# Altium schematic sheet Car2014_finalRev_sch2 (2).SchDoc
size A3
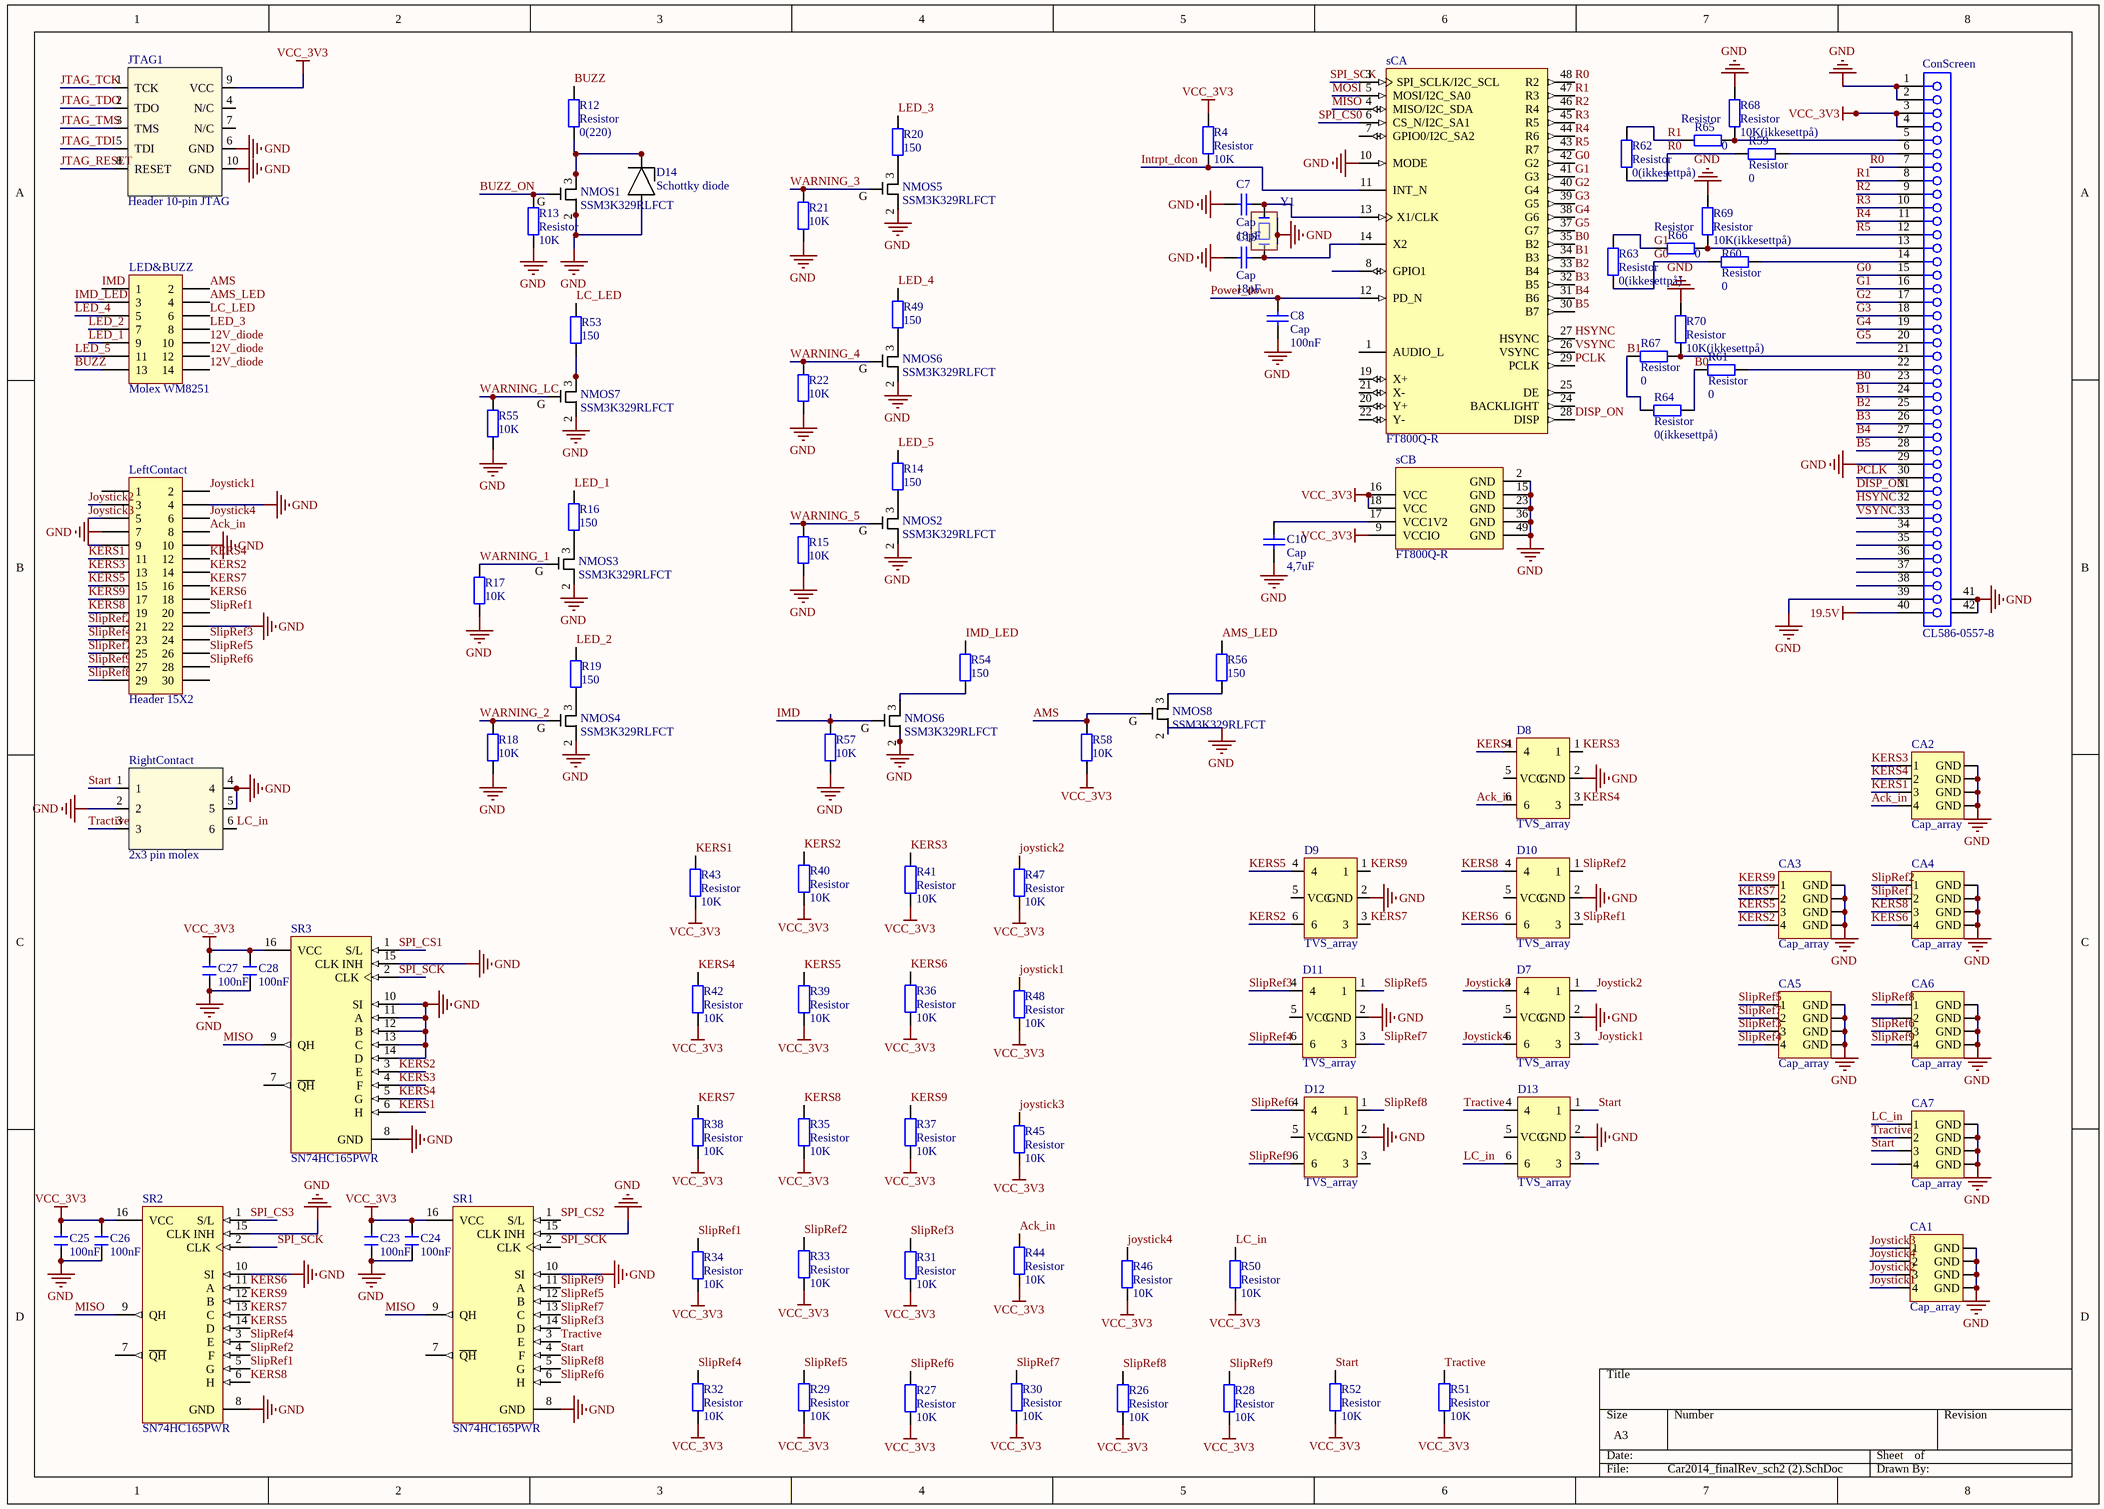
[diagram p0: Car2014_finalRev_sch2 (2).SchDoc]

## Parts
(Parts that share a designator on the sheet are numbered #1, #2 ... from top to bottom, then left to right.)
C7  Cap  value 18pF  [1608[0603]]
C8  Cap  value 100nF  [1608[0603]]
C10  Cap  value 4,7uF  [c0805]
C16  Cap  value 18pF  [1608[0603]]
C23  value 100nF  [CAPC1608L]  (hidden comment: Cap)
C24  value 100nF  [CAPC1608L]  (hidden comment: Cap)
C25  value 100nF  [CAPC1608L]  (hidden comment: Cap)
C26  value 100nF  [CAPC1608L]  (hidden comment: Cap)
C27  value 100nF  [CAPC1608L]  (hidden comment: Cap)
C28  value 100nF  [CAPC1608L]  (hidden comment: Cap)
CA1  Cap_array  [Cap_array_0805]
CA2  Cap_array  [Cap_array_0805]
CA3  Cap_array  [Cap_array_0805]
CA4  Cap_array  [Cap_array_0805]
CA5  Cap_array  [Cap_array_0805]
CA6  Cap_array  [Cap_array_0805]
CA7  Cap_array  [Cap_array_0805]
ConScreen  CL586-0557-8  [FH12A-40S-0.5SH]
D7  TVS_array  [TVS_array_SOT23]
D8  TVS_array  [TVS_array_SOT23]
D9  TVS_array  [TVS_array_SOT23]
D10  TVS_array  [TVS_array_SOT23]
D11  TVS_array  [TVS_array_SOT23]
D12  TVS_array  [TVS_array_SOT23]
D13  TVS_array  [TVS_array_SOT23]
D14  Schottky diode  [1608[0603]]
JTAG1  Header 10-pin JTAG  [10pin Header]
LED&BUZZ  Molex WM8251  [HDR2X7]
LeftContact  Header 15X2  [HDR2X15]
NMOS1  SSM3K329RLFCT  [SOT23]
NMOS2  SSM3K329RLFCT  [SOT23]
NMOS3  SSM3K329RLFCT  [SOT23]
NMOS4  SSM3K329RLFCT  [SOT23]
NMOS5  SSM3K329RLFCT  [SOT23]
NMOS6#1  SSM3K329RLFCT  [SOT23]
NMOS6#2  SSM3K329RLFCT  [SOT23]
NMOS7  SSM3K329RLFCT  [SOT23]
NMOS8  SSM3K329RLFCT  [SOT23]
R4  Resistor  value 10K  [1608[0603]]
R12  Resistor  value 0(220)  [1608[0603]]
R13  Resistor  value 10K  [1608[0603]]
R14  value 150  [RESC1608L]  (hidden comment: Resistor)
R15  value 10K  [RESC1608L]  (hidden comment: Resistor)
R16  value 150  [RESC1608L]  (hidden comment: Resistor)
R17  value 10K  [RESC1608L]  (hidden comment: Resistor)
R18  value 10K  [RESC1608L]  (hidden comment: Resistor)
R19  value 150  [RESC1608L]  (hidden comment: Resistor)
R20  value 150  [RESC1608L]  (hidden comment: Resistor)
R21  value 10K  [RESC1608L]  (hidden comment: Resistor)
R22  value 10K  [RESC1608L]  (hidden comment: Resistor)
R26  Resistor  value 10K  [1608[0603]]
R27  Resistor  value 10K  [1608[0603]]
R28  Resistor  value 10K  [1608[0603]]
R29  Resistor  value 10K  [1608[0603]]
R30  Resistor  value 10K  [1608[0603]]
R31  Resistor  value 10K  [1608[0603]]
R32  Resistor  value 10K  [1608[0603]]
R33  Resistor  value 10K  [1608[0603]]
R34  Resistor  value 10K  [1608[0603]]
R35  Resistor  value 10K  [1608[0603]]
R36  Resistor  value 10K  [1608[0603]]
R37  Resistor  value 10K  [1608[0603]]
R38  Resistor  value 10K  [1608[0603]]
R39  Resistor  value 10K  [1608[0603]]
R40  Resistor  value 10K  [1608[0603]]
R41  Resistor  value 10K  [1608[0603]]
R42  Resistor  value 10K  [1608[0603]]
R43  Resistor  value 10K  [1608[0603]]
R44  Resistor  value 10K  [1608[0603]]
R45  Resistor  value 10K  [1608[0603]]
R46  Resistor  value 10K  [1608[0603]]
R47  Resistor  value 10K  [1608[0603]]
R48  Resistor  value 10K  [1608[0603]]
R49  value 150  [RESC1608L]  (hidden comment: Resistor)
R50  Resistor  value 10K  [1608[0603]]
R51  Resistor  value 10K  [1608[0603]]
R52  Resistor  value 10K  [1608[0603]]
R53  value 150  [RESC1608L]  (hidden comment: Resistor)
R54  value 150  [RESC1608L]  (hidden comment: Resistor)
R55  value 10K  [RESC1608L]  (hidden comment: Resistor)
R56  value 150  [RESC1608L]  (hidden comment: Resistor)
R57  value 10K  [RESC1608L]  (hidden comment: Resistor)
R58  value 10K  [RESC1608L]  (hidden comment: Resistor)
R59  Resistor  value 0  [1608[0603]]
R60  Resistor  value 0  [1608[0603]]
R61  Resistor  value 0  [1608[0603]]
R62  Resistor  value 0(ikkesettpå)  [1608[0603]]
R63  Resistor  value 0(ikkesettpå)  [1608[0603]]
R64  Resistor  value 0(ikkesettpå)  [1608[0603]]
R65  Resistor  value 0  [1608[0603]]
R66  Resistor  value 0  [1608[0603]]
R67  Resistor  value 0  [1608[0603]]
R68  Resistor  value 10K(ikkesettpå)  [1608[0603]]
R69  Resistor  value 10K(ikkesettpå)  [1608[0603]]
R70  Resistor  value 10K(ikkesettpå)  [1608[0603]]
RightContact  2x3 pin molex  [2x3 pin molex]
sC  FT800Q-R  [VQFN-48_N]  (parts A,B of 2)
SR1  SN74HC165PWR  [TSOP65P640X120-16N]
SR2  SN74HC165PWR  [TSOP65P640X120-16N]
SR3  SN74HC165PWR  [TSOP65P640X120-16N]
Y1  Crystal  [SMD-CRYSTAL]  (value not drawn)

## Nets
19.5V: ConScreen.40
GND: C7.1 C8.1 C10.1 C16.1 C23.1 C24.1 C25.1 C26.1 C27.1 C28.1 CA1.5(GND) CA1.6(GND) CA1.7(GND) CA1.8(GND) CA2.5(GND) CA2.6(GND) CA2.7(GND) CA2.8(GND) CA3.5(GND) CA3.6(GND) CA3.7(GND) CA3.8(GND) CA4.5(GND) CA4.6(GND) CA4.7(GND) CA4.8(GND) CA5.5(GND) CA5.6(GND) CA5.7(GND) CA5.8(GND) CA6.5(GND) CA6.6(GND) CA6.7(GND) CA6.8(GND) CA7.5(GND) CA7.6(GND) CA7.7(GND) CA7.8(GND) ConScreen.1 ConScreen.2 ConScreen.29 ConScreen.39 ConScreen.41(MH1) ConScreen.42(MH2) D7.2(GND) D8.2(GND) D9.2(GND) D10.2(GND) D11.2(GND) D12.2(GND) D13.2(GND) D14.2 JTAG1.6(GND) JTAG1.10(GND) LeftContact.4 LeftContact.7 LeftContact.10 LeftContact.22 NMOS1.2(S) NMOS2.2(S) NMOS3.2(S) NMOS4.2(S) NMOS5.2(S) NMOS6#1.2(S) NMOS6#2.2(S) NMOS7.2(S) NMOS8.2(S) R13.2 R15.2 R17.2 R18.2 R21.2 R22.2 R55.1 R57.2 R68.1 R69.2 R70.2 RightContact.2 RightContact.4 RightContact.5 sC.2(GND) sC.10(MODE) sC.15(GND) sC.23(GND) sC.36(GND) sC.49(GND) SR1.8(GND) SR1.10(SI) SR1.15(CLK_INH) SR2.8(GND) SR2.10(SI) SR2.15(CLK_INH) SR3.8(GND) SR3.10(SI) SR3.11(A) SR3.12(B) SR3.13(C) SR3.14(D) SR3.15(CLK_INH) Y1.2 Y1.4
VCC_3V3: C23.2 C24.2 C25.2 C26.2 C27.2 C28.2 ConScreen.3 ConScreen.4 JTAG1.9(VCC) R4.2 R26.2 R27.2 R28.2 R29.2 R30.2 R31.2 R32.2 R33.2 R34.2 R35.2 R36.2 R37.2 R38.2 R39.2 R40.2 R41.2 R42.2 R43.2 R44.1 R45.1 R46.1 R47.1 R48.1 R50.1 R51.2 R52.2 R58.1 sC.9(VCCIO) sC.16(VCC) sC.18(VCC) SR1.16(VCC) SR2.16(VCC) SR3.16(VCC)
12V_diode: LED&BUZZ.10 LED&BUZZ.12 LED&BUZZ.14
Ack_in: CA2.4 D8.6 LeftContact.8 R44.2
AMS: LED&BUZZ.2 NMOS8.1(G) R58.2
AMS_LED: LED&BUZZ.4 R56.1
B0: ConScreen.23 R61.1 R64.2 sC.35(B2)
B1: ConScreen.24 R64.1 R67.1 sC.34(B3)
B2: ConScreen.25 sC.33(B4)
B3: ConScreen.26 sC.32(B5)
B4: ConScreen.27 sC.31(B6)
B5: ConScreen.28 sC.30(B7)
BUZZ: LED&BUZZ.13 R12.1
BUZZ_ON: NMOS1.1(G) R13.1
DISP_ON: ConScreen.31 sC.28(DISP)
G0: ConScreen.15 R60.2 R63.2 sC.42(G2)
G1: ConScreen.16 R63.1 R66.2 sC.41(G3)
G2: ConScreen.17 sC.40(G4)
G3: ConScreen.18 sC.39(G5)
G4: ConScreen.19 sC.38(G6)
G5: ConScreen.20 sC.37(G7)
HSYNC: ConScreen.32 sC.27(HSYNC)
IMD: LED&BUZZ.1 NMOS6#2.1(G) R57.1
IMD_LED: LED&BUZZ.3 R54.2
Intrpt_dcon: R4.1 sC.11(INT_N)
Joystick1: CA1.4 D7.3 LeftContact.2 R48.2
Joystick2: CA1.3 D7.1 LeftContact.3 R47.2
Joystick3: CA1.1 D7.4 LeftContact.5 R45.2
Joystick4: CA1.2 D7.6 LeftContact.6 R46.2
JTAG_RESET: JTAG1.8(RESET)
JTAG_TCK: JTAG1.1(TCK)
JTAG_TDI: JTAG1.5(TDI)
JTAG_TDO: JTAG1.2(TDO)
JTAG_TMS: JTAG1.3(TMS)
KERS1: CA2.3 D8.4 LeftContact.11 R43.1 SR3.6(H)
KERS2: CA3.4 D9.6 LeftContact.14 R40.1 SR3.3(E)
KERS3: CA2.1 D8.1 LeftContact.13 R41.1 SR3.4(F)
KERS4: CA2.2 D8.3 LeftContact.12 R42.1 SR3.5(G)
KERS5: CA3.3 D9.4 LeftContact.15 R39.1 SR2.14(D)
KERS6: CA4.4 D10.6 LeftContact.18 R36.1 SR2.11(A)
KERS7: CA3.2 D9.3 LeftContact.16 R38.1 SR2.13(C)
KERS8: CA4.3 D10.4 LeftContact.19 R35.1 SR2.6(H)
KERS9: CA3.1 D9.1 LeftContact.17 R37.1 SR2.12(B)
LC_in: CA7.1 D13.6 R50.2 RightContact.6
LC_LED: LED&BUZZ.6 R53.1
LED_1: LED&BUZZ.9 R16.2
LED_2: LED&BUZZ.7 R19.2
LED_3: LED&BUZZ.8 R20.2
LED_4: LED&BUZZ.5 R49.2
LED_5: LED&BUZZ.11 R14.2
MISO: sC.4(MISO/I2C_SDA) SR1.9(QH) SR2.9(QH) SR3.9(QH)
MOSI: sC.5(MOSI/I2C_SA0)
PCLK: ConScreen.30 sC.29(PCLK)
Power_down: C8.2 sC.12(PD_N)
R0: ConScreen.7 R59.2 R62.1 sC.48(R2)
R1: ConScreen.8 R62.2 R65.1 sC.47(R3)
R2: ConScreen.9 sC.46(R4)
R3: ConScreen.10 sC.45(R5)
R4: ConScreen.11 sC.44(R6)
R5: ConScreen.12 sC.43(R7)
SlipRef1: CA4.2 D10.3 LeftContact.20 R34.1 SR2.5(G)
SlipRef2: CA4.1 D10.1 LeftContact.21 R33.1 SR2.4(F)
SlipRef3: CA5.3 D11.4 LeftContact.24 R31.1 SR1.14(D)
SlipRef4: CA5.4 D11.6 LeftContact.23 R32.1 SR2.3(E)
SlipRef5: CA5.1 D11.1 LeftContact.26 R29.1 SR1.12(B)
SlipRef6: CA6.3 D12.4 LeftContact.28 R27.1 SR1.6(H)
SlipRef7: CA5.2 D11.3 LeftContact.25 R30.1 SR1.13(C)
SlipRef8: CA6.1 D12.1 LeftContact.29 R26.1 SR1.5(G)
SlipRef9: CA6.4 D12.6 LeftContact.27 R28.1 SR1.11(A)
SPI_CS0: sC.6(CS_N/I2C_SA1)
SPI_CS1: SR3.1(S/L)
SPI_CS2: SR1.1(S/L)
SPI_CS3: SR2.1(S/L)
SPI_SCK: sC.3(SPI_SCLK/I2C_SCL) SR1.2(CLK) SR2.2(CLK) SR3.2(CLK)
Start: CA7.3 D13.1 R52.1 RightContact.1 SR1.4(F)
Tractive: CA7.2 D13.4 R51.1 RightContact.3 SR1.3(E)
VSYNC: ConScreen.33 sC.26(VSYNC)
WARNING_1: NMOS3.1(G) R17.1
WARNING_2: NMOS4.1(G) R18.1
WARNING_3: NMOS5.1(G) R21.1
WARNING_4: NMOS6#1.1(G) R22.1
WARNING_5: NMOS2.1(G) R15.1
WARNING_LC: NMOS7.1(G) R55.2
NetC7_2: C7.2 sC.13(X1/CLK) Y1.3
NetC10_2: C10.2 sC.17(VCC1V2)
NetC16_2: C16.2 sC.14(X2) Y1.1
NetConScreen_5: ConScreen.5 R65.2 R68.2
NetConScreen_6: ConScreen.6 R59.1
NetConScreen_13: ConScreen.13 R66.1 R69.1
NetConScreen_14: ConScreen.14 R60.1
NetConScreen_21: ConScreen.21 R67.2 R70.1
NetConScreen_22: ConScreen.22 R61.2
NetD14_1: D14.1 NMOS1.3(D) R12.2
NetNMOS2_3: NMOS2.3(D) R14.1
NetNMOS3_3: NMOS3.3(D) R16.1
NetNMOS4_3: NMOS4.3(D) R19.1
NetNMOS5_3: NMOS5.3(D) R20.1
NetNMOS6#1_3: NMOS6#1.3(D) R49.1
NetNMOS6#2_3: NMOS6#2.3(D) R54.1
NetNMOS7_3: NMOS7.3(D) R53.2
NetNMOS8_3: NMOS8.3(D) R56.2

Not connected (* = marked no-connect by the designer): CA6 2; CA7 4; ConScreen 34 35 36 37 38; D7 5(VCC); D8 5(VCC); D9 5(VCC); D10 5(VCC); D11 5(VCC); D12 3 5(VCC); D13 3 5(VCC); JTAG1 4(N/C) 7(N/C); LeftContact 1 9 30; sC 1(AUDIO_L) 7(GPIO0/I2C_SA2) 8(GPIO1) 19(X+) 20(Y+) 21(X-) 22(Y-) 24(BACKLIGHT) 25(DE); SR1 7(~{QH}); SR2 7(~{QH}); SR3 7(~{QH})

## Library data of the parts
C7 C8 C10 C16 = Cap: Capacitor
C23-C28 = Cap: Capacitor; Voltage: ?V
ConScreen = CL586-0557-8: FH12 Series, "Flip-Lock" SMT/ZIF FFC/FPC Connector - 0.5mm Spaced Top Contact; Positions: 40; ContactMaterial: Phosphor Bronze; Current: 0.4A; PCB_Layout: Complies with manufacturer's recommendation.; Note: Pad dimensions follow nominal values, Suitable for Wave Soldering, Adjust for Re-flow.; Published: 17-Jul-2002; DatasheetVersion: 13-Nov-2000; PackageVersion: 13-Nov-2000; PackageReference: FH12A-40S-0.5SH; Publisher: Altium Limited; ComponentLink1Description: Manufacturer Link; ComponentLink1URL: http://www.hiroseusa.com/; ComponentLink2Description: Datasheet; ComponentLink2URL: http://www.hirose.co.jp/cataloge_hp/e58605370.pdf
LED&BUZZ = Header 7X2: Header, 7-Pin, Dual row; LatestRevisionDate: 17-Jul-2002; LatestRevisionNote: Re-released for DXP Platform.; Publisher: Altium Limited
LeftContact = Header 15X2: Header, 15-Pin, Dual row; LatestRevisionDate: 17-Jul-2002; LatestRevisionNote: Re-released for DXP Platform.; Publisher: Altium Limited
sC = FT800Q-R: FT800 Single Chip Embedded Graphic Controller (Embedded Video Engine), -40 to +85 degC, 48-pin VQFN, Pb-Free, Tape and Reel; Manufacturer: FTDI; DatasheetVersion: ver 1.1, Aug-2013; PackageVersion: Aug-13; PackageReference: VQFN-48; PackageDescription: 48-Pin Very Thin Quad Flat No-Lead, 7 x 7 x 0.9 mm Body, 0.5 mm Pitch; PartNumber: FT800Q-R; ComponentLink1Description: Manufacturer URL; ComponentLink1URL: http://www.ftdichip.com/; ComponentLink2Description: Datasheet; ComponentLink2URL: http://www.ftdichip.com/Support/Documents/DataSheets/ICs/DS_FT800.pdf